# Altium schematic sheet -LTC3405A_电源.SchDoc
size A4; DocumentNumber: 25; SheetNumber: 25; SheetTotal: 29
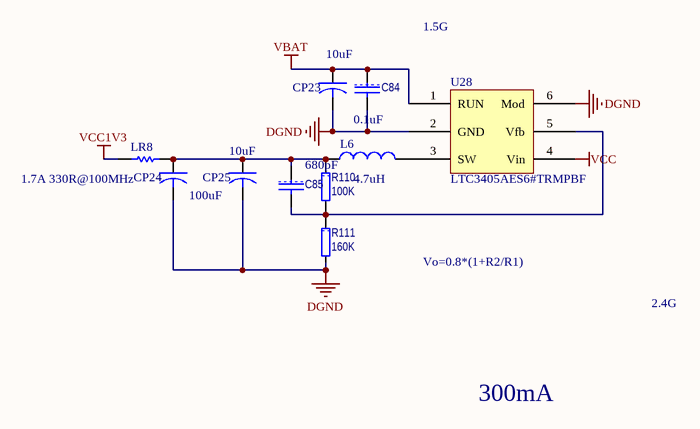
[diagram p0: -LTC3405A_电源.SchDoc]

## Parts
C84  value 0.1uF  [1608[0603]]  (hidden comment: C1608X7R1H104K)
C85  value 680pF  [1608[0603]]  (hidden comment: C1608X7R1H681K)
CP23  value 10uF  [3216[1206]]  (hidden comment: TAJA106K016RNJ)
CP24  value 100uF  [6032]  (hidden comment: TAJC107K016RNJ)
CP25  value 10uF  [3216[1206]]  (hidden comment: TAJA106K016RNJ)
L6  value 4.7uH  [INDP3232]  (hidden comment: CDRH2D18/HP 2R2)
LR8  value 1.7A 330R@100MHz  [0603RV]  (hidden comment: MPZ1608S331A)
R110  100K  [0603R]
R111  160K  [0603R]
U28  LTC3405AES6#TRMPBF  [SOT26A-6N]

## Nets
DGND: C84.2 CP23.2 CP24.2 CP25.2 R111.2 U28.2(GND) U28.6(Mod)
VBAT: C84.1 CP23.1 U28.1(RUN)
VCC: U28.4(Vin)
VCC1V3: LR8.2
NetC85_1: C85.1 CP24.1 CP25.1 L6.1 LR8.1 R110.1
NetC85_2: C85.2 R110.2 R111.1 U28.5(Vfb)
NetL6_2: L6.2 U28.3(SW)

## Notes on the sheet
- 1.5G
- Vo=0.8*(1+R2/R1)
- 2.4G
- 300mA

## Library data of the parts
C84 = CAP: 多层陶瓷电容器MLCC - SMD/SMT 0603 0.1uF 50volts X7R 10%; Manufacturer: TDK; 产品: General Type MLCCs; 产品种类: Low & Medium Capacitance SMD Ceramic Chip Capacitors; 外壳代码 - in: 0603; 外壳代码 - mm: 1608; 封装 / 箱体: 0603 (1608 metric); 封装: Reel; 尺寸: 0.8 mm W x 1.6 mm L x 0.8 mm H; 工作温度范围: - 55 C to + 125 C; 标准包装数量: 4000; 电压额定值: 50 V; 电容-nF: 100 nF; 电容-pF: 100000 pF; 系列: C; Category: 多层陶瓷电容器MLCC - SMD/SMT; ComponentLink1Description: http://www.tdk.com/pdf/general_B11.pdf; ComponentLink1URL: http://www.tdk.com/pdf/general_B11.pdf; Description 1: 多层陶瓷电容器MLCC - SMD/SMT 0603 0.1uF 50volts X7R 10%; Manufacturer Part Number: C1608X7R1H104K; Minimum Order Quantity: 1; Pricing 1: 1=0.160, 50=0.070, 100=0.036, 500=0.019, 1000=0.013, 4000=0.010, 8000=0.009, 12000=0.008, 20000=0.007 (USD); Reeling: True; RoHS - 贸泽: Y; RoHS: RoHS Compliant; Stock 1: 224604; Supplier 1: Mouser; Supplier Part Number 1: 810-C1608X7R1H104K; 制造商: TDK; 容差: 10 %; 温度系数/代码: X7R; 电容: 0.1 uF; 端接类型: SMD/SMT
C85 = CAP: 多层陶瓷电容器MLCC - SMD/SMT 0603 50volts 680pF X7R 10%; Manufacturer: TDK; 尺寸: 0.8 mm W x 1.6 mm L; 工作温度范围: - 55 C to + 125 C; 封装 / 箱体: 0603 (1608 metric); 封装: Reel; 产品: General Type MLCCs; 电压额定值: 50 V; 外壳代码 - in: 0603; 外壳代码 - mm: 1608; 产品种类: Low & Medium Capacitance SMD Ceramic Chip Capacitors; 标准包装数量: 4000; Product Status: End of Life; Supplier 1: Mouser; Supplier Part Number 1: 810-C1608X7R1H681K; Manufacturer Part Number: C1608X7R1H681K; RoHS: RoHS Compliant; Description 1: 多层陶瓷电容器MLCC - SMD/SMT 0603 50volts 680pF X7R 10%; Category: 多层陶瓷电容器MLCC - SMD/SMT; Stock 1: 0; Pricing 1: 4000=0.006, 8000=0.005, 20000=0.004 (USD); 电容: 680 pF; 端接类型: SMD/SMT; 容差: 10 %; 制造商: TDK; 温度系数/代码: X7R; RoHS - 贸泽: Y; Minimum Order Quantity: 4000; Reeling: True; ComponentLink1URL: http://www.tdk.com/pdf/general_B11.pdf; ComponentLink1Description: http://www.tdk.com/pdf/general_B11.pdf
CP23 CP25 = CAPACITOR: 钽质电容器-固体SMD 16volts 10uF 10%; Manufacturer: AVX; ESR: 3 Ohms; 产品: Tantalum Solid Standard Grade - Other Various; 产品种类: SMD Tantalum Capacitors; 制造商库存号: A Case; 外壳代码 - in: 1206; 外壳代码 - mm: 3216; 封装 / 箱体: 1206 (3216 metric); 封装: Reel; 尺寸: 1.6 mm W x 3.2 mm L; 工作温度范围: - 55 C to + 125 C; 损耗因数 DF: 8; 标准包装数量: 2000; 漏泄电流: 1.6 uA; 电压额定值: 16 V; 端接类型: SMD/SMT; 系列: TAJ; 高度: 1.8 mm; Category: 钽质电容器-固体SMD; ComponentLink1Description: http://www.avx.com/docs/Catalogs/taj.pdf; ComponentLink1URL: http://www.avx.com/docs/Catalogs/taj.pdf; Description 1: 钽质电容器-固体SMD 16volts 10uF 10%; Manufacturer Part Number: TAJA106K016RNJ; Minimum Order Quantity: 1; Pricing 1: 1=0.600, 100=0.280, 200=0.250, 500=0.221, 1000=0.200, 2000=0.140, 5000=0.131, 10000=0.124, 25000=0.103 (USD); Reeling: True; RoHS - 贸泽: Y; RoHS: RoHS Compliant; Stock 1: 20335; Supplier 1: Mouser; Supplier Part Number 1: 581-TAJA106K016R; 制造商: AVX; 容差: 10 %; 电容: 10 uF
CP24 = CAPACITOR: 钽质电容器-固体SMD 16V 100uF 10%; Manufacturer: AVX; 尺寸: 3.2 mm W x 6 mm L; 高度: 2.8 mm; 工作温度范围: - 55 C to + 125 C; 封装 / 箱体: 2412 (6032 metric); 封装: Reel; 产品: Tantalum Solid Standard Grade - Other Various; 系列: TAJ; 端接类型: SMD/SMT; ESR: 1 Ohms; 漏泄电流: 16 uA; 外壳代码 - in: 2412; 损耗因数 DF: 8; 制造商库存号: C Case; 产品种类: SMD Tantalum Capacitors; 标准包装数量: 500; Supplier 1: Mouser; Supplier Part Number 1: 581-TAJC107K016RNJ; Manufacturer Part Number: TAJC107K016RNJ; RoHS: RoHS Compliant; Description 1: 钽质电容器-固体SMD 16V 100uF 10%; Category: 钽质电容器-固体SMD; Stock 1: 40; Pricing 1: 1=1.50, 50=0.930, 100=0.720, 500=0.540, 1000=0.480 (USD); 电容: 100 uF; 容差: 10 %; 电压额定值: 16 V; 外壳代码 - mm: 6032; 制造商: AVX; RoHS - 贸泽: Y; Minimum Order Quantity: 1; Reeling: True; ComponentLink1URL: http://www.avx.com/docs/Catalogs/taj.pdf; ComponentLink1Description: http://www.avx.com/docs/Catalogs/taj.pdf
L6 = Inductor: Code_IEC: 1005; parameters: 3.5A; 公司: SUMIDA; Published: 8-Jun-2000; LatestRevisionDate: 29-May-2009; LatestRevisionNote: IPC-7351 Footprint Added.; PackageReference: 0402-A; Publisher: Altium Limited; PackageDescription: Chip Inductor; Code_JEITA: 0402; Manufacturer: *
LR8 = Res Semi: Semiconductor Resistor; 公司: TDK; Published: 8-Jun-2000; LatestRevisionDate: 17-Jul-2002; LatestRevisionNote: Re-released for DXP Platform.; PackageReference: AXIAL-0.5; Publisher: Altium Limited; PackageDescription: Axial Device, Thru-Hole; 2 Leads; 0.5 in Pin Spacing
R110 = RES: Manufacturer: vishay; Model: CRCW0603100K0KKEDTR; Value: 100K; Type: 无铅电阻
R111 = RES: Manufacturer: vishay; Model: CRCW0603160K0KKEDTR; Value: 160K; Type: 无铅电阻
U28 = LTC3405A: IC REG BUCK SYNC ADJ .3A SOT23-6; Manufacturer: Linear Technology; Output Type: Adjustable; Number of Outputs: 1; Voltage - Output: 0.8 V ~ 6 V; Voltage - Input: 2.5 V ~ 5.5 V; PWM Type: Current Mode, Burst Mode?; Frequency - Switching: 1.5MHz; Current - Output: 300mA; Synchronous Rectifier: Yes; Supplier 1: Digi-Key; Supplier Part Number 1: LTC3405AES6#TRMPBFCT-ND; Manufacturer Part Number: LTC3405AES6#TRMPBF; RoHS: RoHS Compliant; Description 1: IC REG BUCK SYNC ADJ .3A SOT23-6; Category: Integrated Circuits (ICs); Stock 1: 2124; Pricing 1: 1=3.86, 25=3.442, 100=3.0979 (USD); Packaging: Cut Tape (CT); Type: Step-Down (Buck); Operating Temperature: -40°C ~ 85°C; Mounting Type: Surface Mount; Package / Case: SOT-23-6 Thin, TSOT-23-6; Supplier Device Package: TSOT-23-6; ComponentLink1URL: http://cds.linear.com/docs/en/datasheet/3405afa.pdf; ComponentLink1Description: http://cds.linear.com/docs/en/datasheet/3405afa.pdf